# EAGLE design Powersupply (EAGLE 6.2)
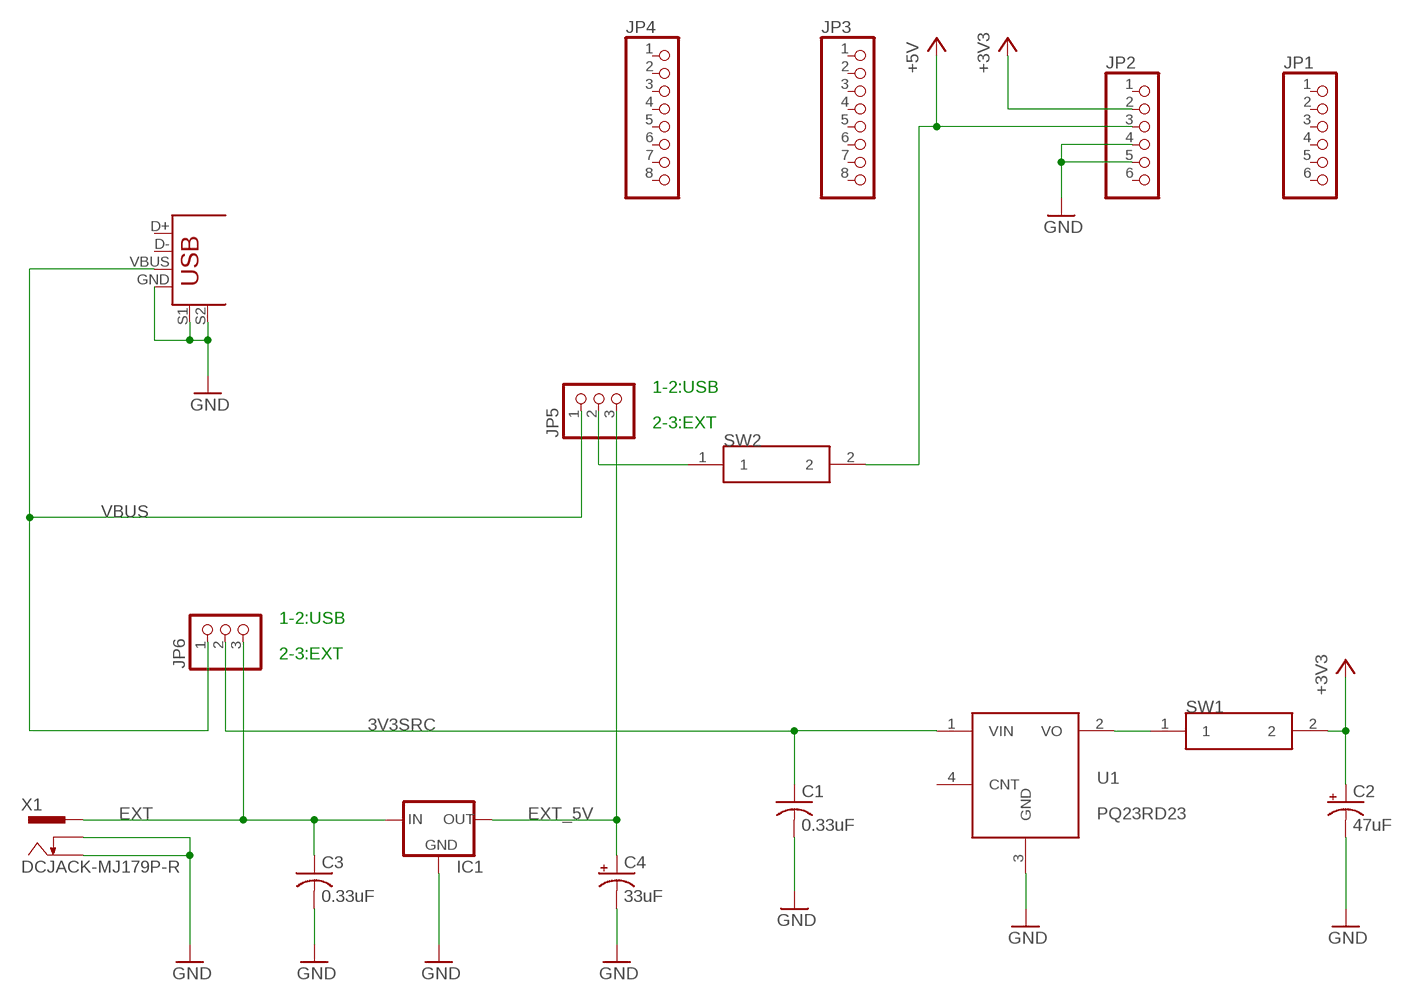
[diagram p0: schematic, sheet 1]

## Parts
C1  0.33uF  CAP  [C025-040X050]
C2  47uF  CPOL-US  [CPOL-US]
C3  0.33uF  CAP  [C025-040X050]
C4  33uF  CPOL-US  [CPOL-US]
IC1  78XXL  [78XXL]
JP1  PINHD-1X6  [1X06]
JP2  PINHD-1X6  [1X06]
JP3  PINHD-1X8  [1X08]
JP4  PINHD-1X8  [1X08]
JP5  PINHD-1X3  [1X03]
JP6  PINHD-1X3  [1X03]
SW1  POLYSWITCH  [POLYSWITCH]
SW2  POLYSWITCH  [POLYSWITCH]
U1  PQ23RD23  [PQ3RD23]
U$1  USB+SHIELD  [USB-B-PTH]
X1  DCJACK-MJ179P-R  [MJ-179P-R]

## Nets
3V3SRC: C1.1 JP6.2 U1.1(VIN)
+3V3: C2.+ JP2.2 SW1.2
+5V: JP2.3 SW2.2
EXT: C3.1 IC1.IN JP6.3 X1.1
EXT_5V: C4.+ IC1.OUT JP5.3
GND: C1.2 C2.- C3.2 C4.- IC1.GND JP2.4 JP2.5 U1.3(GND) U$1.GND U$1.S1 U$1.S2 X1.2 X1.3
N$1: JP5.2 SW2.1
N$2: SW1.1 U1.2(VO)
VBUS: JP5.1 JP6.1 U$1.VBUS
Unconnected: JP1.1 JP1.2 JP1.3 JP1.4 JP1.5 JP1.6 JP2.1 JP2.6 JP3.1 JP3.2 JP3.3 JP3.4 JP3.5 JP3.6 JP3.7 JP3.8 JP4.1 JP4.2 JP4.3 JP4.4 JP4.5 JP4.6 JP4.7 JP4.8 U1.4(CNT) U$1.D+ U$1.D-

## Notes on the sheet
- 1-2:USB
- 2-3:EXT
- 1-2:USB
- 2-3:EXT

## Library data of the parts
C1 C3 = kimai0827:CAP
C2 C4 = kimai0827:CPOL-US
IC1 = v-reg:78XXL: VOLTAGE REGULATOR
JP1 JP2 = pinhead:PINHD-1X6: PIN HEADER
JP3 JP4 = pinhead:PINHD-1X8: PIN HEADER
JP5 JP6 = pinhead:PINHD-1X3: PIN HEADER
SW1 SW2 = kimai0827:POLYSWITCH
U1 = kimai0827:PQ23RD23
U$1 = SparkFun-Connectors:USB+SHIELD: USB+Shield USB connector with shield pins connectable
X1 = kamiki-dcjack:DCJACK: DC JACK 2.1mmφ - 5.5mmφ DCジャック、基板用。

## Net classes
1 GND: width 1.27 mm, drill 0.406 mm
2 5V: width 1.27 mm, drill 0.406 mm
3 3V3: width 1.27 mm, drill 0.406 mm
4 VBUS: width 1.27 mm, drill 0.406 mm
5 EXT: width 1.27 mm, drill 0.406 mm
6 3V3SRC: width 1.27 mm, drill 0.406 mm

## Board
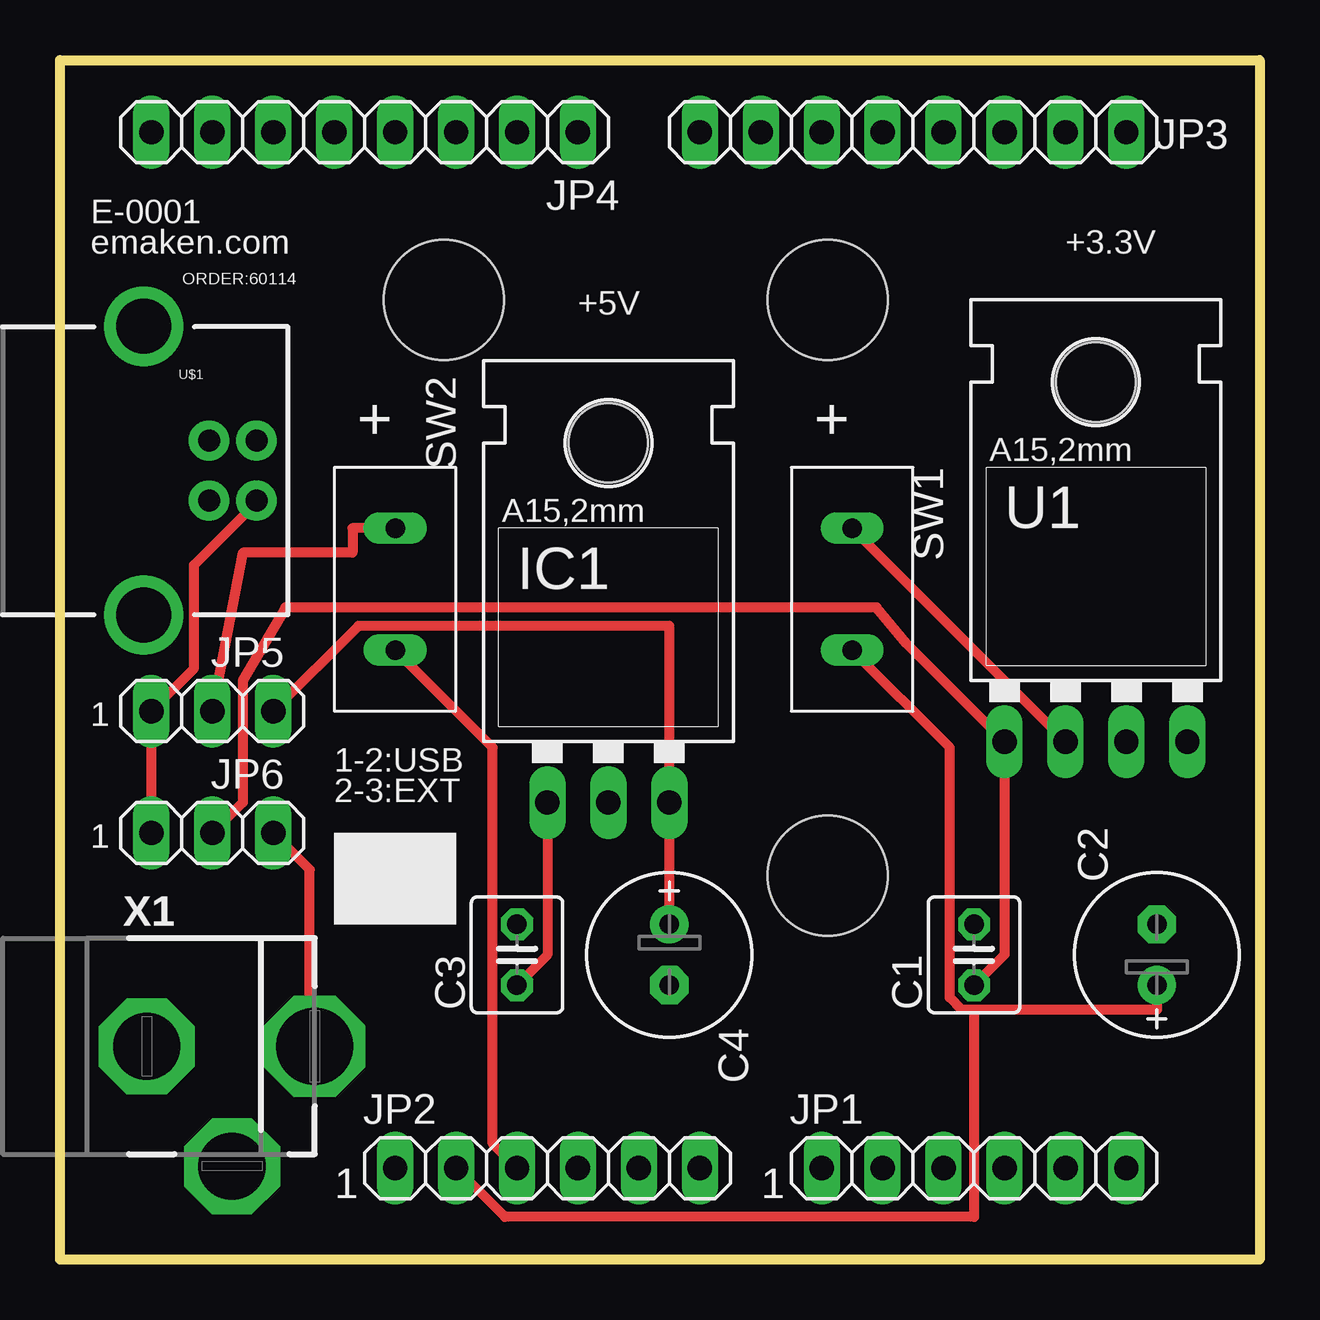
[diagram p1: board, top side]
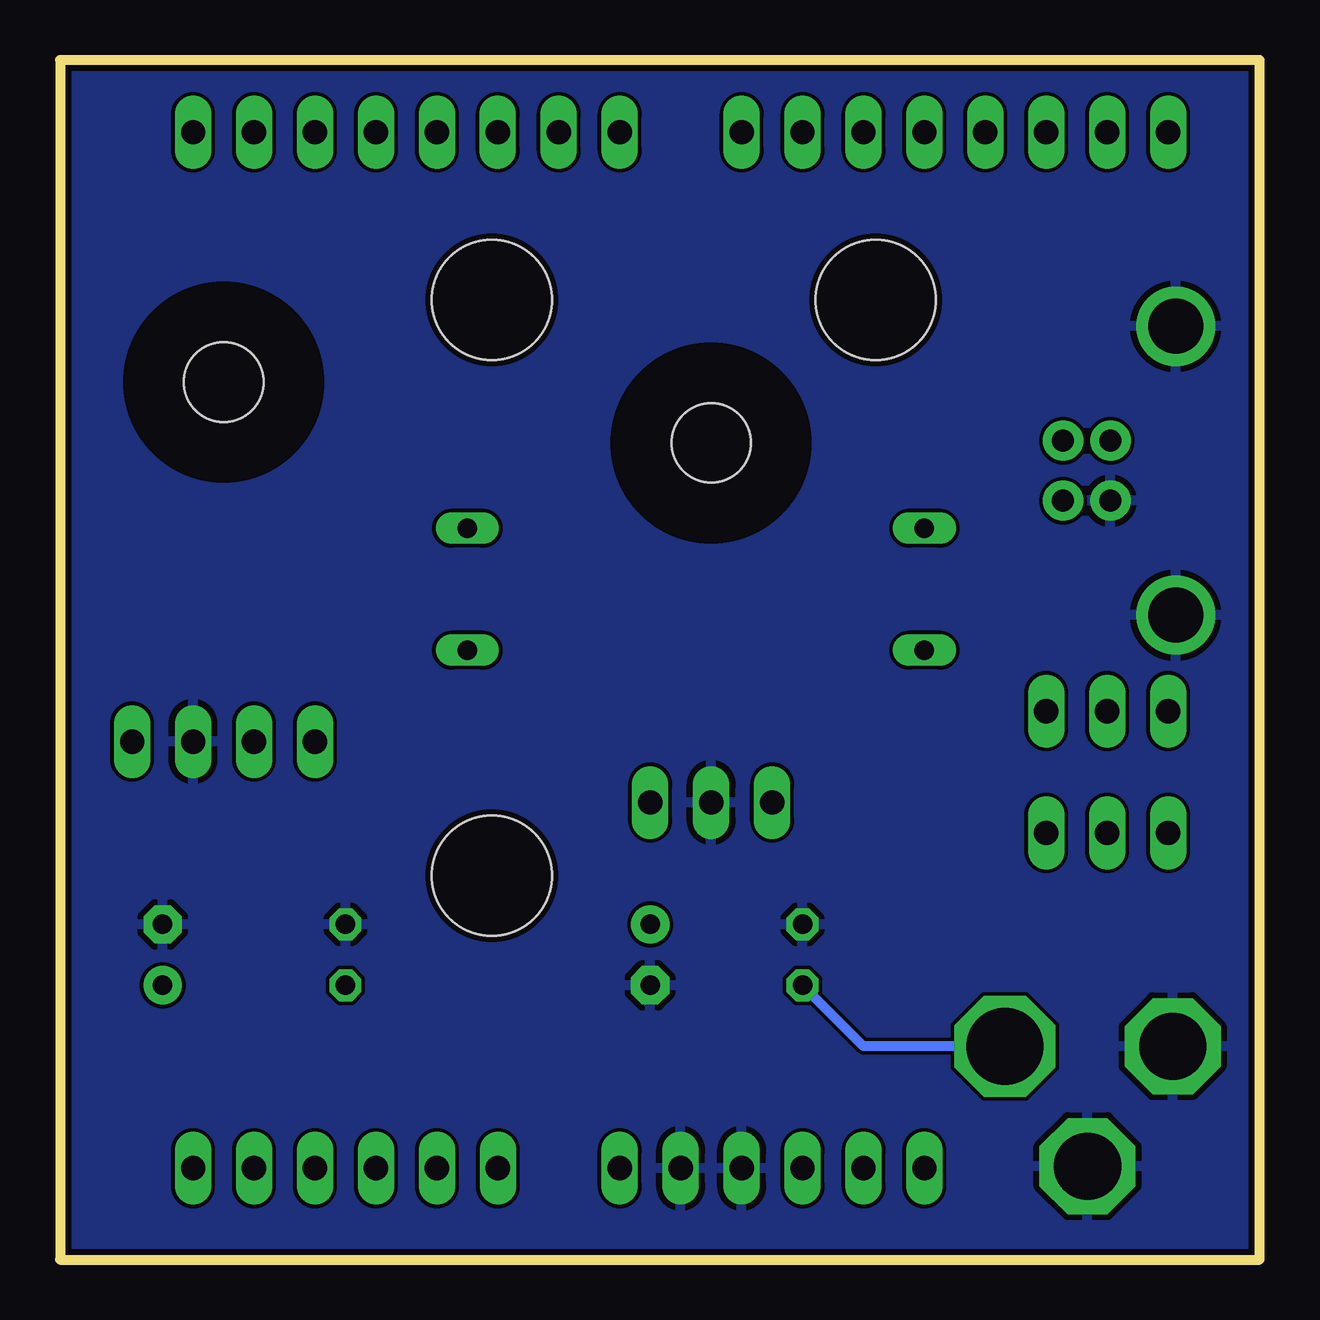
[diagram p2: board, bottom side, seen from below]

Size 50 x 50 mm. Coordinates in mm from the lower left corner, seen from the top.
Outline: 0,50 50,50 50,0 0,0 0,50
Copper layers (1*16): Top 0.035mm / dielectric 1.5mm / Bottom 0.035mm
Design rules: minimum track width 6mil, minimum drill 12mil, track to track 6mil, track to pad 6mil, pad to pad 6mil, via to via 6mil, smd to smd 0mil, copper to edge 10mil, drill to drill 10mil, minimum pad ring 10mil, minimum via ring 6mil, stop-mask expansion 2mil, vias tented up to drill 100mil, thermal gap 10mil
Holes 5 mm at 32,40 32,16 16,40

### Footprints (pad centres in the part's own frame; a part is rotated, then mirrored left to right if it is on the bottom)
C025-040X050 = drill 0.813 octagon: 1 0,0; 2 2.54,0
CPOL-US = drill 0.813 pad 1.6: + 0,0 | drill 0.813 pad 1.6 octagon: - 2.54,0
78XXL = drill 1.016 long: GND 0,-3.81; IN -2.54,-3.81; OUT 2.54,-3.81 | hole 3.302: 0,11.176
1X06 = drill 1.016 long: 1 -6.35,0; 2 -3.81,0; 3 -1.27,0; 4 1.27,0; 5 3.81,0; 6 6.35,0
1X08 = drill 1.016 long: 1 -8.89,0; 2 -6.35,0; 3 -3.81,0; 4 -1.27,0; 5 1.27,0; 6 3.81,0; 7 6.35,0; 8 8.89,0
1X03 = drill 1.016 long: 1 -2.54,0; 2 0,0; 3 2.54,0
POLYSWITCH = drill 0.813 long: 1 0,0; 2 5.08,0
PQ3RD23 = drill 1.016 long: 1 -1.27,0; 2 1.27,0; 3 3.81,0; 4 6.35,0 | hole 3.302: 2.54,14.986
USB-B-PTH = drill 0.914 pad 1.676: D+ 0,1.25; D- 1.981,1.25; GND 0,-1.25; VBUS 1.981,-1.25 | drill 2.286: S1 -2.718,-6.02; S2 -2.718,6.02
MJ-179P-R = drill 3.2 pad 4 octagon: 1 3,0 | drill 2.8 pad 4 octagon: 2 -4,0; 3 -0.45,-5

### Placement (x,y rotation side)
C1  38.1,11.43 90 top
C2  45.72,11.43 90 top
C3  19.05,11.43 90 top
C4  25.4,13.97 270 top
IC1  22.86,22.86 0 top
JP1  38.1,3.81 0 top
JP2  20.32,3.81 0 top
JP3  35.56,46.99 0 top
JP4  12.7,46.99 0 top
JP5  6.35,22.86 0 top
JP6  6.35,17.78 0 top
SW1  33.02,30.48 270 top
SW2  13.97,30.48 270 top
U1  40.64,21.59 0 top
U$1  6.21,32.88 0 top
X1  7.62,8.89 0 top

### Tracks (layer width: path | path; a pad name or v marks a point on that pad's centre or on a via)
3V3SRC
  Top 0.406: C1.1 39.37,12.7 U1.1 35.31,25.65 34.04,27.18 9.4,27.18 7.62,24.13 7.62,19.05 JP6.2
+3V3
  Top 0.406: SW1.2 37.08,21.34 37.08,10.92 37.59,10.41 38.1,10.41 | 38.1,10.41 45.72,10.41 C2.+ | JP2.2 18.54,1.78 38.1,1.78 38.1,10.41
+5V
  Top 0.406: SW2.2 18.03,21.34 18.03,4.83 JP2.3
EXT
  Top 0.406: C3.1 20.32,12.7 IC1.IN | JP6.3 10.41,16.26 10.41,8.89 X1.1
  Bottom 0.406: C3.1 16.51,8.89 X1.1
EXT_5V
  Top 0.406: C4.+ IC1.OUT 25.4,26.42 12.45,26.42 JP5.3
GND
  pour Bottom: -1.27,50.8 50.8,50.8 50.8,-1.27 -1.27,-1.27
N$1
  Top 0.406: SW2.1 12.19,30.48 12.19,29.46 7.62,29.46 JP5.2
N$2
  Top 0.406: U1.2 SW1.1
VBUS
  Top 0.406: JP6.1 JP5.1 5.59,24.64 5.59,28.96 8.13,31.5 U$1.VBUS

### Text on the board
tPlace: E-0001
tNames: emaken.com | +3.3V | ORDER:60114 | +5V | + | + | 1 | 1-2:USB | 2-3:EXT | 1